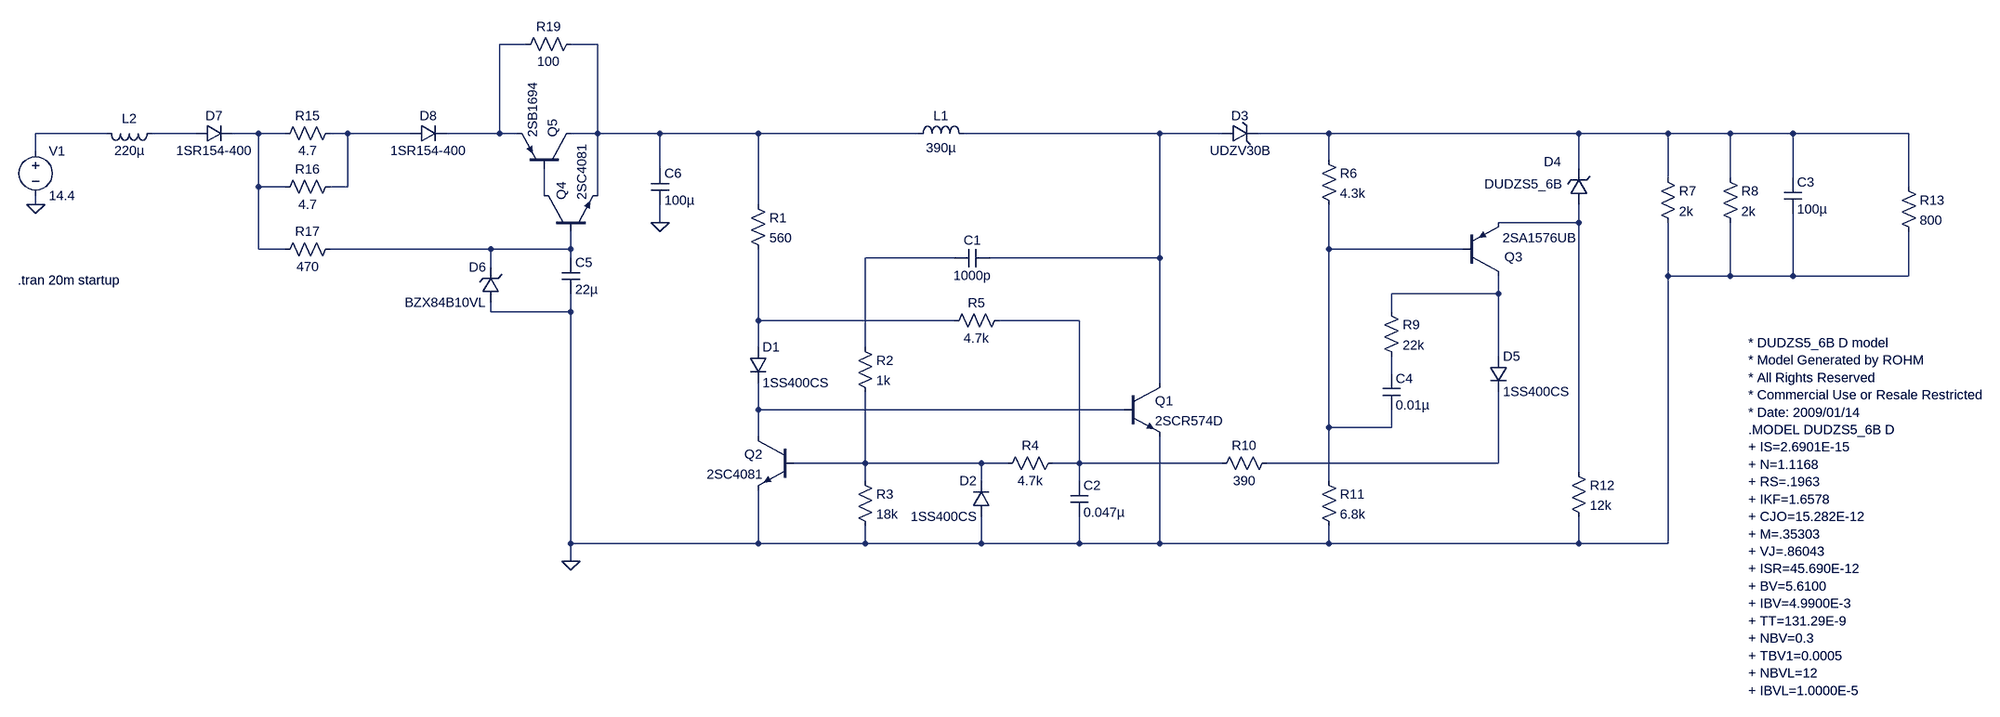
[diagram p0: schematic X00-4100-00.asc]
X00-4100-00.asc, the LTspice schematic file:
Version 4
SHEET 1 3840 920
WIRE -384 -352 -432 -352
WIRE -256 -352 -304 -352
WIRE -1136 -192 -1264 -192
WIRE -976 -192 -1056 -192
WIRE -864 -192 -912 -192
WIRE -816 -192 -864 -192
WIRE -704 -192 -736 -192
WIRE -592 -192 -704 -192
WIRE -432 -192 -432 -352
WIRE -432 -192 -528 -192
WIRE -400 -192 -432 -192
WIRE -256 -192 -256 -352
WIRE -256 -192 -304 -192
WIRE -144 -192 -256 -192
WIRE 32 -192 -144 -192
WIRE 320 -192 32 -192
WIRE 752 -192 400 -192
WIRE 864 -192 752 -192
WIRE 1056 -192 928 -192
WIRE 1504 -192 1056 -192
WIRE 1664 -192 1504 -192
WIRE 1776 -192 1664 -192
WIRE 1888 -192 1776 -192
WIRE 2096 -192 1888 -192
WIRE -1264 -160 -1264 -192
WIRE 1056 -144 1056 -192
WIRE -144 -128 -144 -192
WIRE 1504 -128 1504 -192
WIRE 1664 -112 1664 -192
WIRE 1776 -112 1776 -192
WIRE 1888 -112 1888 -192
WIRE -864 -96 -864 -192
WIRE -816 -96 -864 -96
WIRE -704 -96 -704 -192
WIRE -704 -96 -736 -96
WIRE 2096 -96 2096 -192
WIRE -352 -80 -352 -128
WIRE -256 -80 -256 -192
WIRE -1264 -64 -1264 -80
WIRE 32 -64 32 -192
WIRE -144 -32 -144 -64
WIRE 1504 -32 1504 -64
WIRE 1504 -32 1360 -32
WIRE -864 16 -864 -96
WIRE -816 16 -864 16
WIRE -448 16 -736 16
WIRE -304 16 -304 -16
WIRE -304 16 -448 16
WIRE 1056 16 1056 -64
WIRE 1296 16 1056 16
WIRE -304 32 -304 16
WIRE 384 32 224 32
WIRE 752 32 752 -192
WIRE 752 32 448 32
WIRE -448 48 -448 16
WIRE 1664 64 1664 -32
WIRE 1776 64 1776 -32
WIRE 1776 64 1664 64
WIRE 1888 64 1888 -48
WIRE 1888 64 1776 64
WIRE 2096 64 2096 -16
WIRE 2096 64 1888 64
WIRE 1360 96 1360 64
WIRE 1360 96 1168 96
WIRE -448 128 -448 112
WIRE -304 128 -304 96
WIRE -304 128 -448 128
WIRE 1168 128 1168 96
WIRE 32 144 32 16
WIRE 384 144 32 144
WIRE 608 144 464 144
WIRE 32 192 32 144
WIRE 224 192 224 32
WIRE 1360 208 1360 96
WIRE 1168 240 1168 208
WIRE 752 256 752 32
WIRE 32 304 32 256
WIRE 688 304 32 304
WIRE 1056 336 1056 16
WIRE 1168 336 1168 304
WIRE 1168 336 1056 336
WIRE 32 352 32 304
WIRE 224 400 224 272
WIRE 224 400 96 400
WIRE 432 400 224 400
WIRE 480 400 432 400
WIRE 608 400 608 144
WIRE 608 400 560 400
WIRE 864 400 608 400
WIRE 1360 400 1360 272
WIRE 1360 400 944 400
WIRE 1504 416 1504 -32
WIRE 224 432 224 400
WIRE 432 432 432 400
WIRE 608 432 608 400
WIRE 1056 432 1056 336
WIRE -304 544 -304 128
WIRE 32 544 32 448
WIRE 32 544 -304 544
WIRE 224 544 224 512
WIRE 224 544 32 544
WIRE 432 544 432 496
WIRE 432 544 224 544
WIRE 608 544 608 496
WIRE 608 544 432 544
WIRE 752 544 752 352
WIRE 752 544 608 544
WIRE 1056 544 1056 512
WIRE 1056 544 752 544
WIRE 1504 544 1504 496
WIRE 1504 544 1056 544
WIRE 1664 544 1664 64
WIRE 1664 544 1504 544
WIRE -304 576 -304 544
FLAG -1264 -64 0
FLAG -144 -32 0
FLAG -304 576 0
SYMBOL diode 16 192 R0
SYMATTR InstName D1
SYMATTR Value 1SS400CS
SYMBOL res 16 -80 R0
SYMATTR InstName R1
SYMATTR Value 560
SYMBOL ind 304 -176 R270
WINDOW 0 32 56 VTop 2
WINDOW 3 5 56 VBottom 2
SYMATTR InstName L1
SYMATTR Value 390µ
SYMATTR SpiceLine Rser=1
SYMBOL npn 688 256 R0
SYMATTR InstName Q1
SYMATTR Value 2SCR574D
SYMBOL cap 448 16 R90
WINDOW 0 0 32 VBottom 2
WINDOW 3 32 32 VTop 2
SYMATTR InstName C1
SYMATTR Value 1000p
SYMBOL res 208 176 R0
SYMATTR InstName R2
SYMATTR Value 1k
SYMBOL res 208 416 R0
SYMATTR InstName R3
SYMATTR Value 18k
SYMBOL res 576 384 R90
WINDOW 0 0 56 VBottom 2
WINDOW 3 32 56 VTop 2
SYMATTR InstName R4
SYMATTR Value 4.7k
SYMBOL cap 592 432 R0
SYMATTR InstName C2
SYMATTR Value 0.047µ
SYMBOL res 480 128 R90
WINDOW 0 0 56 VBottom 2
WINDOW 3 32 56 VTop 2
SYMATTR InstName R5
SYMATTR Value 4.7k
SYMBOL zener 864 -176 R270
WINDOW 0 32 32 VTop 2
WINDOW 3 0 32 VBottom 2
SYMATTR InstName D3
SYMATTR Value UDZV30B
SYMATTR Description Diode
SYMATTR Type diode
SYMBOL res 1040 -160 R0
SYMATTR InstName R6
SYMATTR Value 4.3k
SYMBOL zener 1520 -64 R180
WINDOW 0 48 77 Left 2
WINDOW 3 46 37 Left 2
SYMATTR InstName D4
SYMATTR Value DUDZS5_6B
SYMATTR Description Diode
SYMATTR Type diode
SYMBOL res 1648 -128 R0
SYMATTR InstName R7
SYMATTR Value 2k
SYMBOL res 1760 -128 R0
SYMATTR InstName R8
SYMATTR Value 2k
SYMBOL cap 1872 -112 R0
SYMATTR InstName C3
SYMATTR Value 100µ
SYMATTR SpiceLine Rser=0.5m
SYMBOL pnp 1296 64 M180
WINDOW 0 75 34 Left 2
WINDOW 3 71 68 Left 2
SYMATTR InstName Q3
SYMATTR Value 2SA1576UB
SYMBOL res 1152 112 R0
SYMATTR InstName R9
SYMATTR Value 22k
SYMBOL cap 1152 240 R0
SYMATTR InstName C4
SYMATTR Value 0.01µ
SYMBOL res 960 384 R90
WINDOW 0 0 56 VBottom 2
WINDOW 3 32 56 VTop 2
SYMATTR InstName R10
SYMATTR Value 390
SYMBOL voltage -1264 -176 R0
WINDOW 123 0 0 Left 0
WINDOW 39 0 0 Left 0
SYMATTR InstName V1
SYMATTR Value 14.4
SYMBOL npn 96 352 M0
SYMATTR InstName Q2
SYMATTR Value 2SC4081
SYMBOL diode 448 496 R180
WINDOW 0 24 64 Left 2
WINDOW 3 24 0 Left 2
SYMATTR InstName D2
SYMATTR Value 1SS400CS
SYMBOL diode 1344 208 R0
SYMATTR InstName D5
SYMATTR Value 1SS400CS
SYMBOL res 1040 416 R0
SYMATTR InstName R11
SYMATTR Value 6.8k
SYMBOL res 1488 400 R0
SYMATTR InstName R12
SYMATTR Value 12k
SYMBOL res 2080 -112 R0
SYMATTR InstName R13
SYMATTR Value 800
SYMBOL ind -1040 -208 R90
WINDOW 0 5 56 VBottom 2
WINDOW 3 32 56 VTop 2
SYMATTR InstName L2
SYMATTR Value 220µ
SYMBOL res -720 -208 R90
WINDOW 0 0 56 VBottom 2
WINDOW 3 32 56 VTop 2
SYMATTR InstName R15
SYMATTR Value 4.7
SYMBOL res -720 -112 R90
WINDOW 0 0 56 VBottom 2
WINDOW 3 32 56 VTop 2
SYMATTR InstName R16
SYMATTR Value 4.7
SYMBOL res -720 0 R90
WINDOW 0 0 56 VBottom 2
WINDOW 3 32 56 VTop 2
SYMATTR InstName R17
SYMATTR Value 470
SYMBOL zener -432 112 R180
WINDOW 0 24 64 Left 2
WINDOW 3 24 0 Left 2
SYMATTR InstName D6
SYMATTR Value BZX84B10VL
SYMATTR Description Diode
SYMATTR Type diode
SYMBOL cap -320 32 R0
SYMATTR InstName C5
SYMATTR Value 22µ
SYMBOL npn -352 -16 R270
SYMATTR InstName Q4
SYMATTR Value 2SC4081
SYMBOL pnp -304 -128 M270
SYMATTR InstName Q5
SYMATTR Value 2SB1694
SYMBOL cap -160 -128 R0
SYMATTR InstName C6
SYMATTR Value 100µ
SYMATTR SpiceLine Rser=0.5m
SYMBOL res -288 -368 R90
WINDOW 0 0 56 VBottom 2
WINDOW 3 32 56 VTop 2
SYMATTR InstName R19
SYMATTR Value 100
SYMBOL diode -976 -176 R270
WINDOW 0 32 32 VTop 2
WINDOW 3 0 32 VBottom 2
SYMATTR InstName D7
SYMATTR Value 1SR154-400
SYMBOL diode -592 -176 R270
WINDOW 0 32 32 VTop 2
WINDOW 3 0 32 VBottom 2
SYMATTR InstName D8
SYMATTR Value 1SR154-400
TEXT -1296 72 Left 2 !.tran 20m startup
TEXT 1808 184 Left 2 !* DUDZS5_6B D model\n* Model Generated by ROHM\n* All Rights Reserved\n* Commercial Use or Resale Restricted\n* Date: 2009/01/14\n.MODEL DUDZS5_6B D\n+ IS=2.6901E-15\n+ N=1.1168\n+ RS=.1963\n+ IKF=1.6578\n+ CJO=15.282E-12\n+ M=.35303\n+ VJ=.86043\n+ ISR=45.690E-12\n+ BV=5.6100\n+ IBV=4.9900E-3\n+ TT=131.29E-9\n+ NBV=0.3\n+ TBV1=0.0005\n+ NBVL=12\n+ IBVL=1.0000E-5

The netlist it stands for:
* X00-4100-00.asc
D1 N015 N018 1SS400CS
R1 N002 N015 560
L1 N002 N007 390µ Rser=1
Q1 N007 N018 0 0 2SCR574D
C1 N007 N013 1000p
R2 N013 N019 1k
R3 N019 0 18k
R4 N016 N019 4.7k
C2 N016 0 0.047µ
R5 N016 N015 4.7k
D3 N007 N008 UDZV30B
R6 N008 N012 4.3k
D4 N010 N008 DUDZS5_6B
R7 N008 0 2k
R8 N008 0 2k
C3 N008 0 100µ Rser=0.5m
Q3 N014 N012 N010 0 2SA1576UB
R9 N014 N017 22k
C4 N017 N012 0.01µ
R10 N020 N016 390
V1 N003 0 14.4
Q2 N018 N019 0 0 2SC4081
D2 0 N019 1SS400CS
D5 N014 N020 1SS400CS
R11 N012 0 6.8k
R12 N010 0 12k
R13 N008 0 800
L2 N004 N003 220µ
R15 N006 N005 4.7
R16 N006 N005 4.7
R17 N011 N005 470
D6 0 N011 BZX84B10VL
C5 N011 0 22µ
Q4 N009 N011 N002 0 2SC4081
Q5 N002 N009 N001 0 2SB1694
C6 N002 0 100µ Rser=0.5m
R19 N002 N001 100
D7 N004 N005 1SR154-400
D8 N006 N001 1SR154-400
.model D D
.lib standard.dio
.model NPN NPN
.model PNP PNP
.lib standard.bjt
.tran 20m startup
* DUDZS5_6B D model
* Model Generated by ROHM
* All Rights Reserved
* Commercial Use or Resale Restricted
* Date: 2009/01/14
.MODEL DUDZS5_6B D
+ IS=2.6901E-15
+ N=1.1168
+ RS=.1963
+ IKF=1.6578
+ CJO=15.282E-12
+ M=.35303
+ VJ=.86043
+ ISR=45.690E-12
+ BV=5.6100
+ IBV=4.9900E-3
+ TT=131.29E-9
+ NBV=0.3
+ TBV1=0.0005
+ NBVL=12
+ IBVL=1.0000E-5
.backanno
.end